# Altium schematic sheet Sheet1.SchDoc
size 420 x 297 mm; Address1: Address1; Address2: Address2; Address3: Address3; Address4: Address4; DocumentNumber: АБВГ.123456.001 Э3; SheetNumber: 1; Scale: 1:1; DocumentType: Схема электрическая принципиальная; FirstReferrence: АБВГ.123456.001
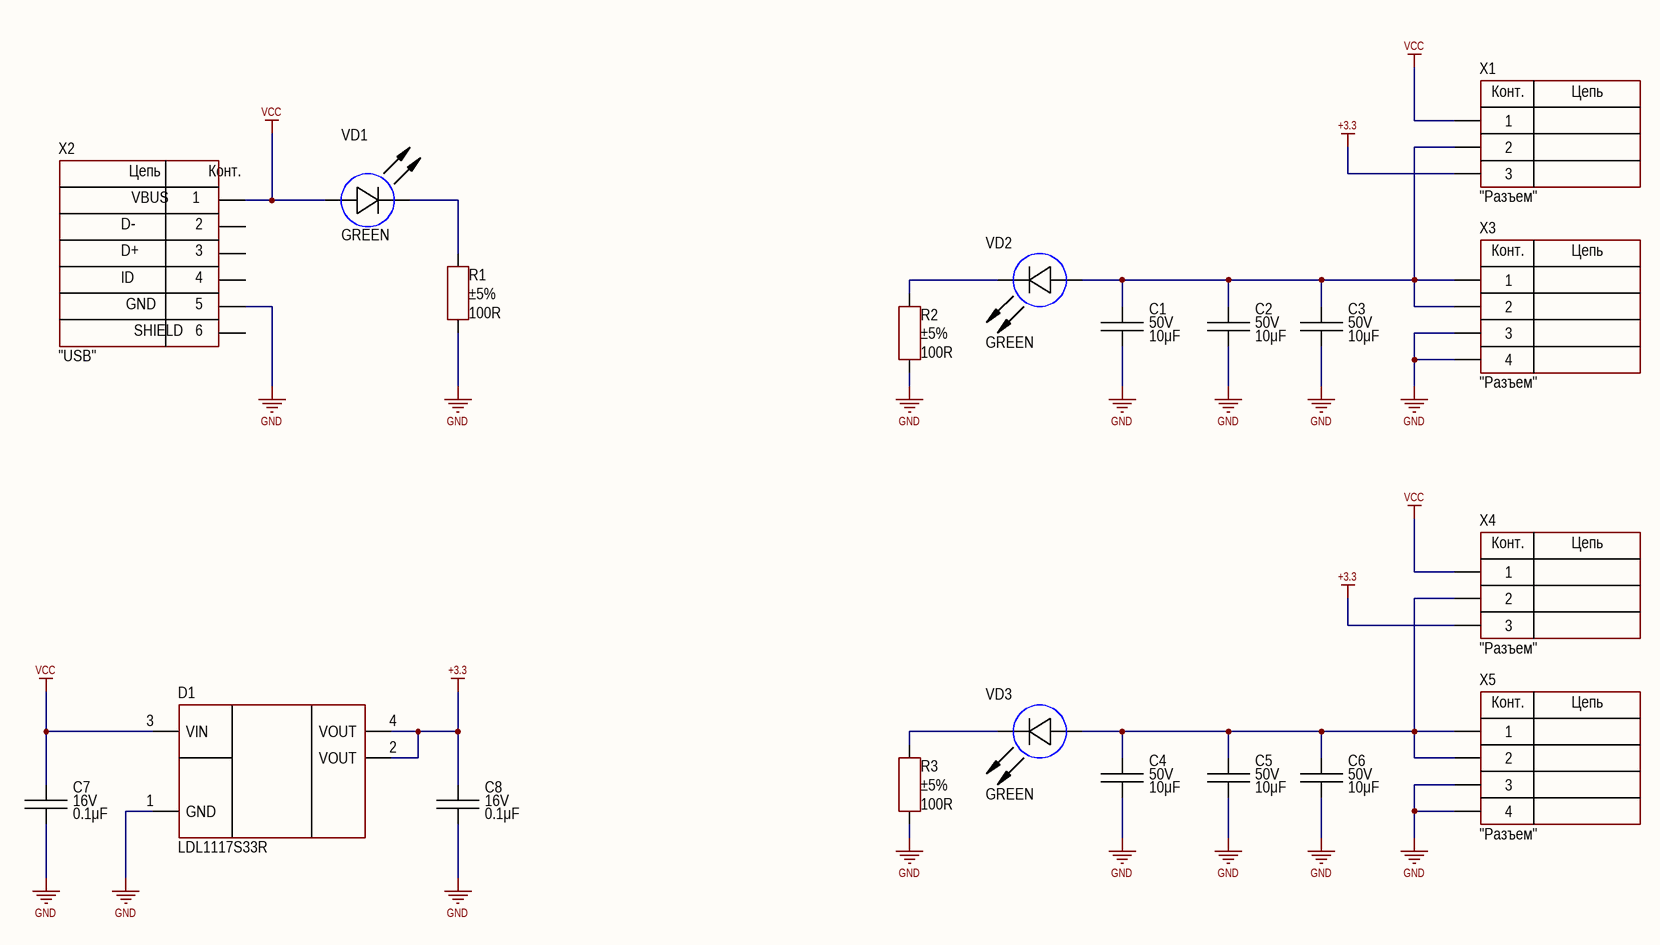
[diagram p0: Sheet1.SchDoc]

## Parts
C1  value 10μF  Voltage: 50V  [CAP: 1206]
C2  value 10μF  Voltage: 50V  [CAP: 1206]
C3  value 10μF  Voltage: 50V  [CAP: 1206]
C4  value 10μF  Voltage: 50V  [CAP: 1206]
C5  value 10μF  Voltage: 50V  [CAP: 1206]
C6  value 10μF  Voltage: 50V  [CAP: 1206]
C7  value 0.1μF  Voltage: 16V  [CAP: 0805]
C8  value 0.1μF  Voltage: 16V  [CAP: 0805]
D1  (no value)  [SOT223]
R1  value 100R  Tolerance: ±5%  [RES: 0603]
R2  value 100R  Tolerance: ±5%  [RES: 0603]
R3  value 100R  Tolerance: ±5%  [RES: 0603]
VD1  Color: GREEN  [LED: 0603R]
VD2  Color: GREEN  [LED: 0603R]
VD3  Color: GREEN  [LED: 0603R]
X1  CommentText: "Разъем"  [CON: PLS-3]
X2  CommentText: "USB"  [CON: USB micro-A (ZX62-B-5PA)]
X3  CommentText: "Разъем"  [CON: PLD-4]
X4  CommentText: "Разъем"  [CON: PLS-3]
X5  CommentText: "Разъем"  [CON: PLD-4]

## Nets
+3.3: C8.1 D1.2(VOUT) D1.4(VOUT) X1.3 X4.3
GND: C1.1 C2.1 C3.1 C4.1 C5.1 C6.1 C7.2 C8.2 D1.1(GND) R1.1 R2.2 R3.2 X2.5 X3.3 X3.4 X5.3 X5.4
VCC: C7.1 D1.3(VIN) VD1.1(A) X1.1 X2.1 X4.1
NetC1_2: C1.2 C2.2 C3.2 VD2.1(A) X1.2 X3.1 X3.2
NetC4_2: C4.2 C5.2 C6.2 VD3.1(A) X4.2 X5.1 X5.2
NetR1_2: R1.2 VD1.2(C)
NetR2_1: R2.1 VD2.2(C)
NetR3_1: R3.1 VD3.2(C)

Not connected (* = marked no-connect by the designer): X2 0 2 3 4

## Notes on the sheet
- Перв. примен.
- Справ. №
- Подп. и дата
- Инв. № дубл.
- Взам. инв. №
- Разраб.
- Изм.
- Лист
- № докум.
- Подп.
- Дата
- Лит.
- Масса
- Масштаб
- Пров.
- Т.контр.
- Листов
- Инв. № подл.
- Утв.
- Н.контр.
- 2.106-A3
- Копировал
- Формат А3
- (in symbol Connector_USB_micro_B) Цепь; Конт.; VBUS; D-; D+; ID; GND; SHIELD; 6
- (in symbol PLD-4) Конт.; Цепь
- (in symbol PLS-3) Конт.; Цепь

## Library data of the parts
C1-C6 = Ceramic_1206: Manufacturer: Yageo; PartNumber: CC1206KRX7R9BB104; ValueManufacturerPartNumber: Ceramic capacitor, 10μF, X7R, ±10%, 50V, 1206, -55...+125°C; TypeCapacitor: Ceramic capacitor; Tolerance: ±10%; TypeDielectric: X7R; Package: 1206; HelpURL: https://www.digikey.com/product-detail/en/yageo/CC1206KRX7R9BB104/311-1179-1-ND/303089; Temperature: -55...+125°C
C7 C8 = Ceramic_0805: Manufacturer: Yageo; PartNumber: CC0805KRX7R7BB104; ValueManufacturerPartNumber: Ceramic capacitor, 0.1μF, X7R, ±10%, 16V, 0805, -55...+125°C; TypeCapacitor: Ceramic capacitor; Tolerance: ±10%; TypeDielectric: X7R; Package: 0805; HelpURL: https://www.digikey.com/product-detail/en/yageo/CC0805KRX7R7BB104/311-1142-1-ND/303052; Temperature: -55...+125°C
D1 = LDL1117S33R: Linear voltage regulator; Manufacturer: STMicroelectronics; ValueManufacturerPartNumber: Linear voltage regulator, input 3.9...18V, 0.6V, output 3.3V, 1.2A, -40...+85°C, SOT223; VoltageInput: input 3.9...18V; MaxDropout: 0.6V; CurrentOutput: 1.2A; VoltageOutput: output 3.3V; HelpURL: https://www.digikey.com/product-detail/en/stmicroelectronics/LDL1117S33R/497-17239-1-ND/7102079; Package: SOT223; ComponentType: Linear voltage regulator; Temperature: -40...+85°C; PartNumber: LDL1117S33R
R1-R3 = Resistor_0603: Manufacturer: Yageo; PartNumber: RC0603JR-07100RL; ValueManufacturerPartNumber: Resistor film, 100R, ±5%, 0603, 0.1W, -55...+125°C; TypeResistor: Resistor film; Power: 0.1W; Package: 0603; HelpURL: https://www.digikey.com/product-detail/en/yageo/RC0603JR-07100RL/311-100GRCT-ND/729644; Temperature: -55...+125°C
VD1-VD3 = LED_single: ValueManufacturerPartNumber: LED, Green, *, *, *, -55...+150°C; TypeDiode: LED; Manufacturer: *; Package: *; HelpURL: *; Temperature: -55...+150°C; Current: *; VoltageDrop: *; PartNumber: *; ColorParameter: Green
X1 X4 = PLS-3: Manufacturer: Connfly; ValueManufacturerPartNumber: Connector, 3pin, 2.54mm, 500VAC, 3A; TypeConnector: Connector; VoltageMax: 500VAC; Pitch: 2.54mm; CurrentMax: 3A; Multichannel: 3pin; HelpURL: https://www.chipdip.ru/product/pls-3; PartNumber: PLS-3
X2 = Connector_USB_micro_B: Manufacturer: Hirose Electric; ValueManufacturerPartNumber: USB micro B; PartNumber: ZX62-B-5PA; HelpURL: https://www.digikey.com/product-detail/en/hirose-electric-co-ltd/ZX62-B-5PA/H11579CT-ND/1851090; TypeConnector: USB micro B
X3 X5 = PLD-4: Manufacturer: Connfly; ValueManufacturerPartNumber: Connector, 6pin, 2.54mm, 500VAC, 3A; TypeConnector: Connector; VoltageMax: 500VAC; Pitch: 2.54mm; CurrentMax: 3A; Multichannel: 6pin; HelpURL: https://www.chipdip.ru/product/pld-6; PartNumber: PLD-4